# EAGLE design NTAG I2C plus Class4 Antenna v1 (EAGLE 7.4.0)
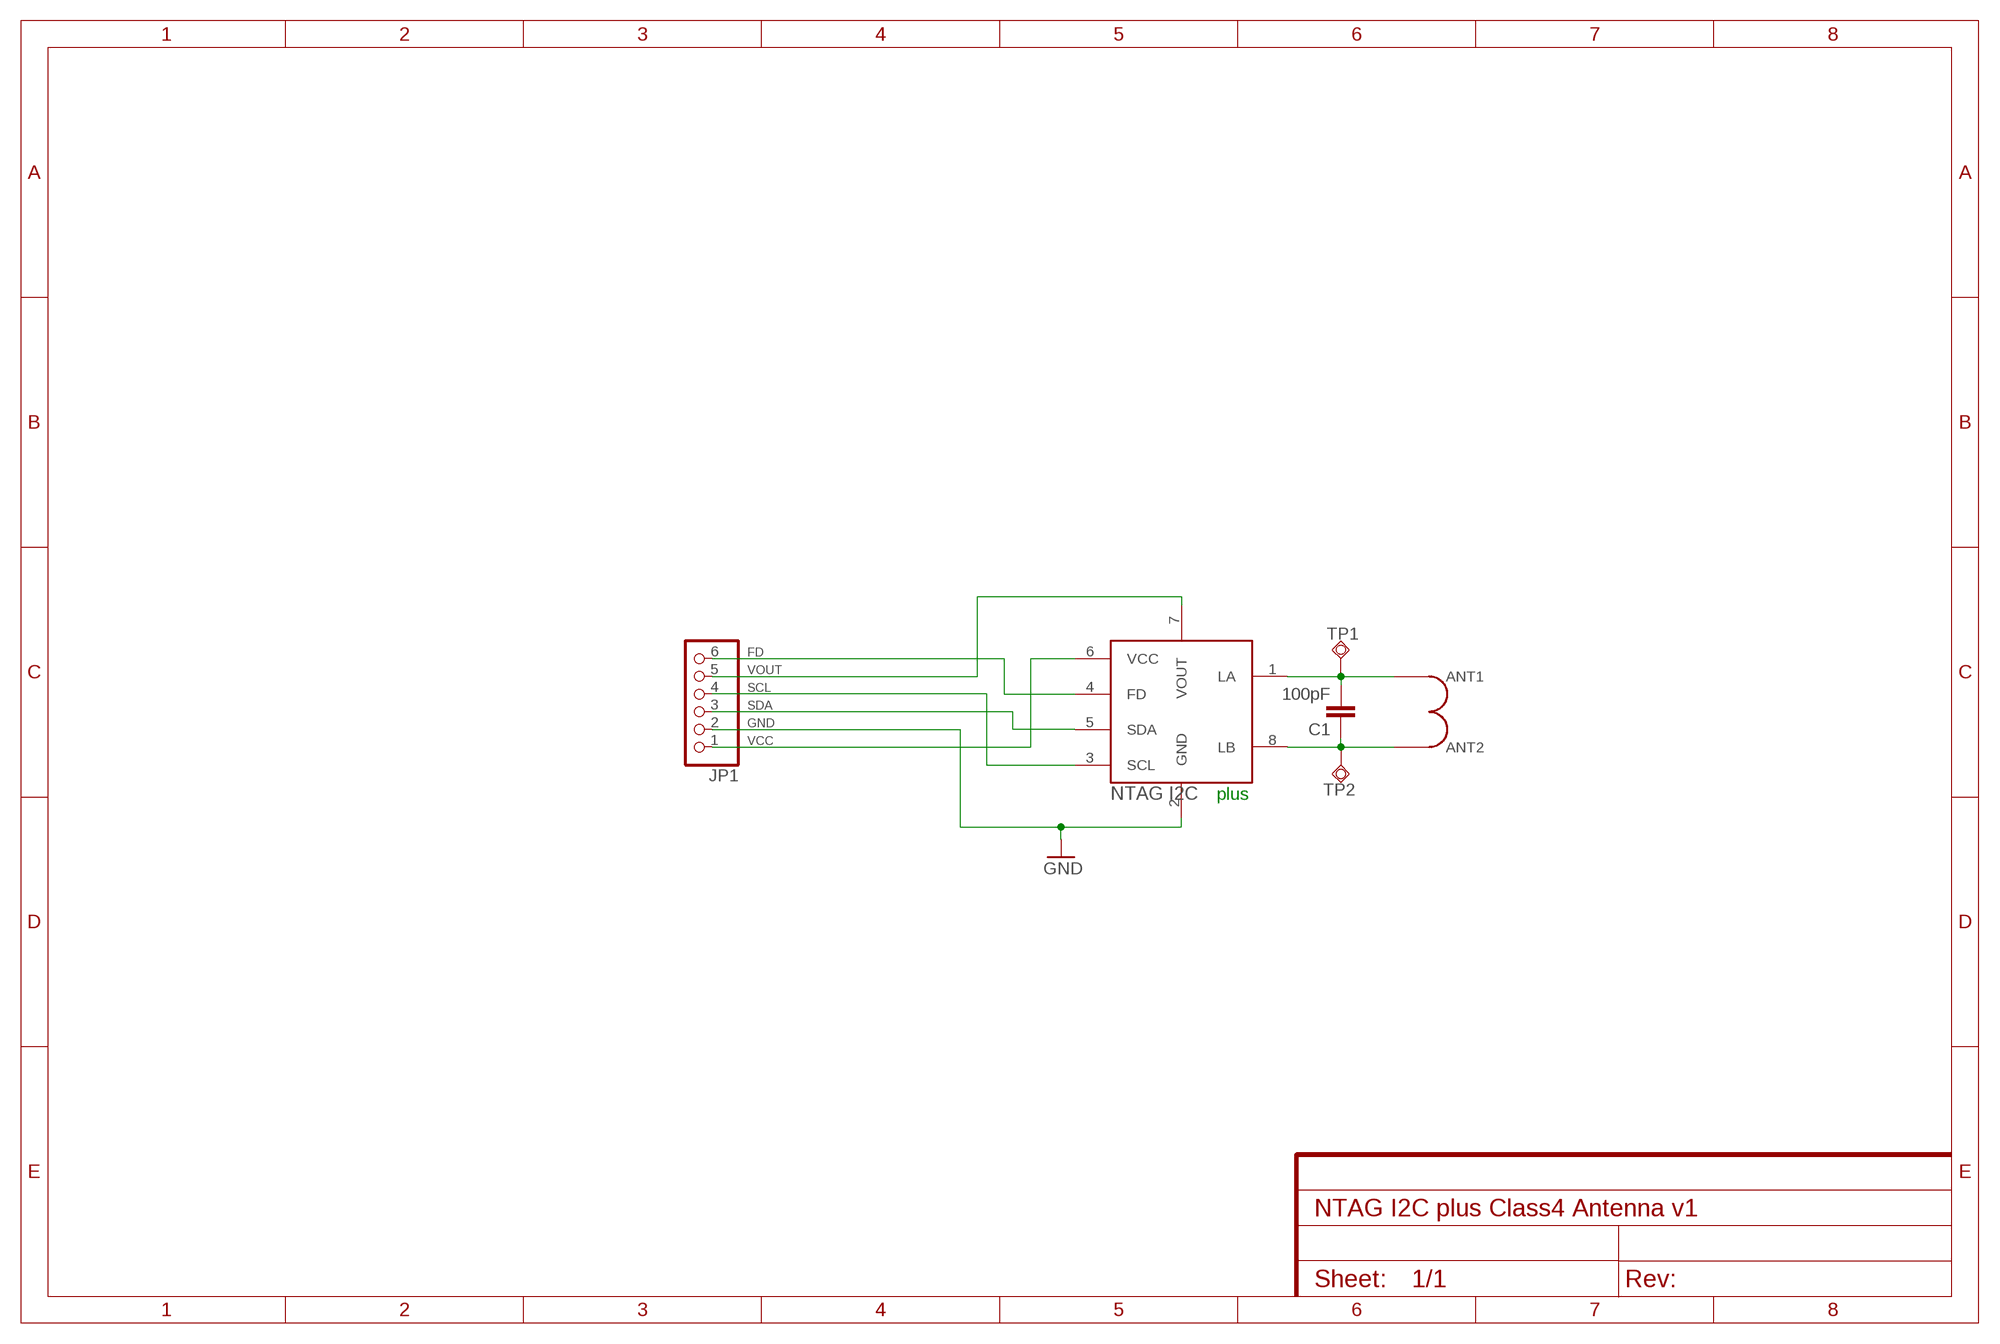
[diagram p0: schematic, sheet 1]

## Parts
C1  100pF  C-EUC0402K  [C0402K]
JP1  PINHD-1X6/90  [1X06/90]
TP1  TPSQPAD1-13  [P1-13]
TP2  TPSQPAD1-13  [P1-13]
U$1  ENERGY-HARVESTING_3-TURNS54X27_3TURN_THIN  [54X27_3TURNS_THIN]
U$3  NTAG_I2CXQFN8  [SOT902-3]

## Nets
GND: JP1.2 U$3.2(GND)
N$1: C1.2 TP1.TP U$1.ANT1 U$3.1(LA)
N$2: C1.1 TP2.TP U$1.ANT2 U$3.8(LB)
N$3: JP1.1 U$3.6(VCC)
N$5: JP1.3 U$3.5(SDA)
N$6: JP1.4 U$3.3(SCL)
N$7: JP1.6 U$3.4(FD)
N$8: JP1.5 U$3.7(VOUT)

## Notes on the sheet
- FD
- VOUT
- SCL
- SDA
- GND
- VCC
- plus

## Library data of the parts
C1 = rcl:C-EU: CAPACITOR, European symbol
JP1 = pinhead (2):PINHD-1X6: PIN HEADER
TP1 TP2 = testpad:TPSQ: Test pad
U$1 = NTAG_Antennas:ENERGY-HARVESTING_3-TURNS
U$3 = NTAG_I2C:NTAG_I2C

## Board
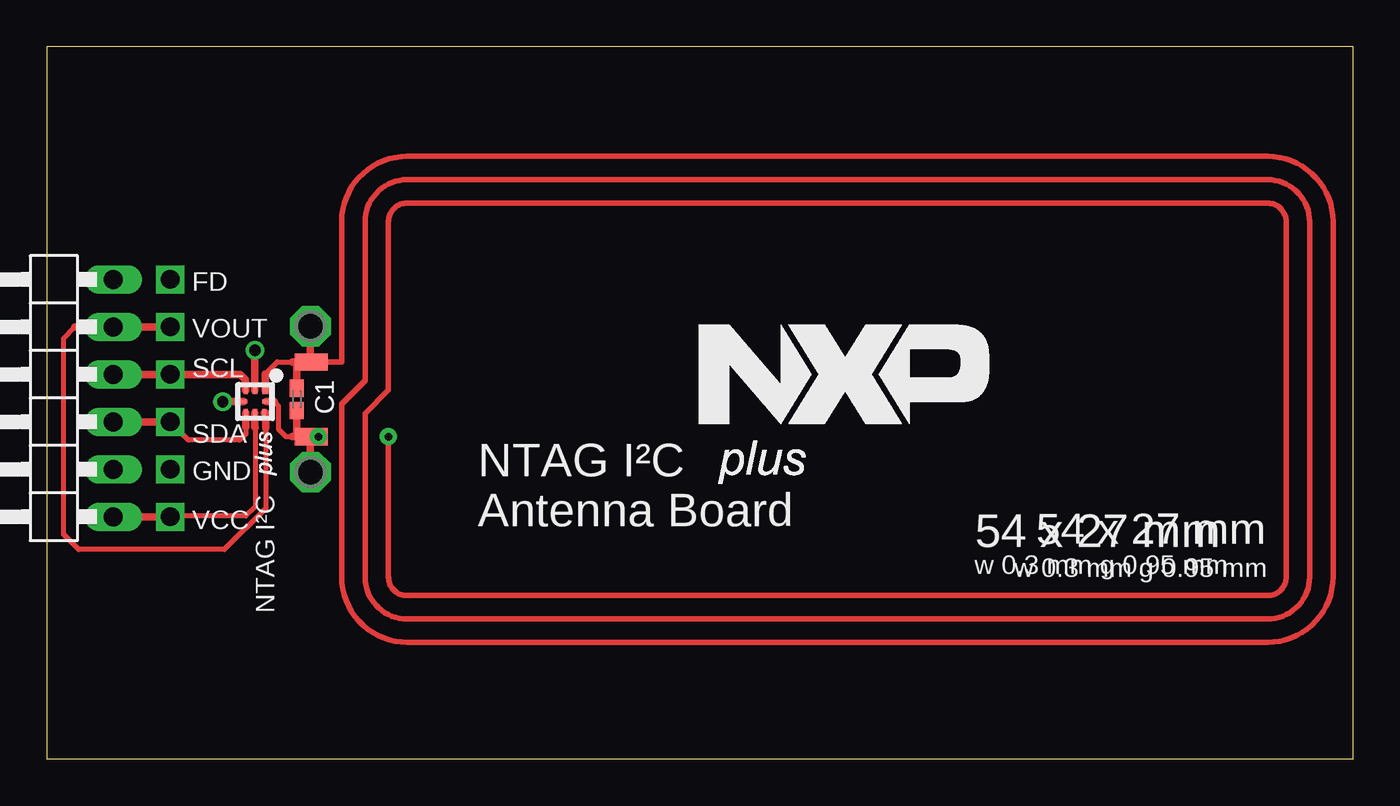
[diagram p1: board, top side]
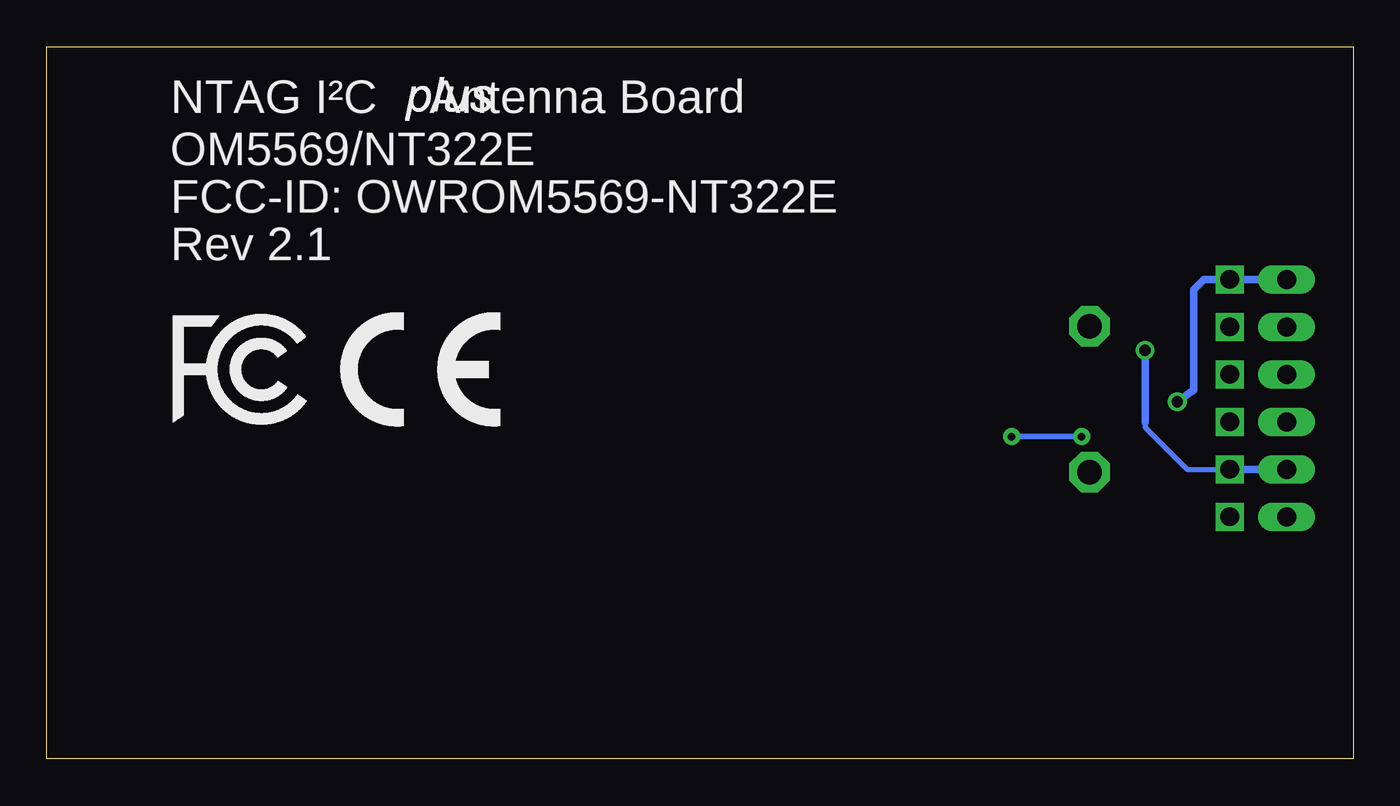
[diagram p2: board, bottom side, seen from below]

Size 69.85 x 38.1 mm. Coordinates in mm from the lower left corner, seen from the top.
Outline: 0,0 69.85,0 69.85,38.1 0,38.1 0,0
Copper layers (1*16): Top 0.035mm / dielectric 1.5mm / Bottom 0.035mm
Design rules "default": minimum track width 10mil, minimum drill 24mil, track to track 8mil, track to pad 8mil, pad to pad 8mil, via to via 8mil, smd to smd 8mil, copper to edge 40mil, drill to drill 8mil, minimum pad ring 10mil, minimum via ring 8mil, stop-mask expansion 4mil, vias tented up to drill 0mil, thermal gap 10mil

### Footprints (pad centres in the part's own frame; a part is rotated, then mirrored left to right if it is on the bottom)
C0402K = smd 0.925 x 0.74: 1 -0.6,0; 2 0.6,0
1X06/90 = drill 1.016 long: 1 -6.35,-3.81; 2 -3.81,-3.81; 3 -1.27,-3.81; 4 1.27,-3.81; 5 3.81,-3.81; 6 6.35,-3.81
P1-13 = drill 1.321 pad 2.159 octagon: TP 0,0
54X27_3TURNS_THIN = smd 1.778 x 0.914: ANT1 -26.855,2; ANT2 -26.855,-2 | drill 0.4: P$1 -26.48,-2; P$2 -22.73,-2
SOT902-3 = smd 0.4 x 0.32: 1 -0.6,0.55 | smd 0.4 x 0.22: 2 -0.6,0; 3 -0.6,-0.5; 5 0.6,-0.5; 6 0.6,0; 7 0.6,0.5 | smd 0.22 x 0.4: 4 0,-0.6; 8 0,0.6

### Placement (x,y rotation side)
C1  13.37,19.24 90 top
JP1  -0.25,19.3 90 top
TP1  14.1,23.15 0 top
TP2  14.1,15.35 0 top
U$1  41,19.24 0 top
U$3  11.13,19.11 270 top

### Tracks (layer width: path | path; a pad name or v marks a point on that pad's centre or on a via)
GND  (via drill 0.6)
  Top 0.406: U$3.2 v11.13,21.86
  Bottom 0.254: 11.13,17.99 11.13,17.74 8.88,15.49 6.59,15.49
  Bottom 0.406: v11.13,21.86 11.13,17.99 | 6.59,15.49 JP1.2
N$1
  Top 0.254: 11.68,20.6 12.32,21.24 13.13,21.24
  Top 0.406: 13.13,21.24 U$1.ANT1 | C1.2 13.37,21.24 U$1.ANT1 | TP1.TP 14.1,21.24 U$1.ANT1 | 11.68,20.6 U$3.1
N$2
  Top 0.254: 12.15,19.11 12.38,18.89 12.38,17.64 12.79,17.24 13.13,17.24
  Top 0.406: 13.13,17.24 U$1.ANT2 | C1.1 13.37,17.24 U$1.ANT2 | TP2.TP 14.1,17.24 U$1.ANT2 | U$3.8 12.15,19.11
N$3
  Top 0.254: 11.15,17.73 11.15,13.49 10.65,12.99 6.61,12.99 6.57,12.95
  Top 0.406: U$3.6 11.13,17.75 11.15,17.73 | 6.57,12.95 JP1.1
N$4  (via drill 1)
  other vias: 6.6,25.65
N$5
  Top 0.254: 10.64,17.76 10.64,17.38 10.31,17.05 7.57,17.05 6.6,18.02 | JP1.3
  Top 0.406: U$3.5 10.63,17.77 10.64,17.76 | JP1.3 6.6,18.02
N$6
  Top 0.406: 10.63,20.11 U$3.3 10.62,19.72 10.62,20.31 10.36,20.57 JP1.4
N$7  (via drill 0.6)
  Top 0.406: U$3.4 v9.41,19.11
  Bottom 0.406: v9.41,19.11 8.53,19.74 8.53,25.11 7.99,25.65 JP1.6
N$8
  Top 0.254: 11.7,17.7 11.7,13.4 9.5,11.2 1.7,11.2 0.9,12 0.9,22.5 1.5,23.1
  Top 0.406: U$3.7 11.7,18.51 11.7,17.7 | 1.5,23.1 3.54,23.1 JP1.5
N$9  (via drill 1)
  Top 0.254: 3.51,23.11 3.5,23.1
  Top 0.406: 3.51,23.11 v6.6,23.11
N$10  (via drill 1)
  other vias: 6.6,20.57
N$11  (via drill 1)
  other vias: 6.6,18.03
N$12  (via drill 1)
  other vias: 6.6,15.49
N$13  (via drill 1)
  other vias: 6.6,12.95

### Text on the board
tPlace: FD | VOUT | SCL | SDA | NTAG I²C / Antenna Board | GND | VCC | 54 x 27 mm | w 0.3 mm g 0.95 mm | NTAG I²C
tNames: C1
bNames: NTAG I²C Antenna Board | OM5569/NT322E | FCC-ID: OWROM5569-NT322E | Rev 2.1